# Altium schematic sheet UART.SchDoc
size A3; DocumentNumber: 4; SheetNumber: 4; SheetTotal: 10; PageSetup: Record=PageOptions|CenterHorizontal=True|CenterVertical=True|PrintScale=0.97|XCorrection=1.00|YCorrection=1.00|PrintKind=1|BorderSize=5000000|LeftOffset=0|BottomOffset=0|Orientation=2|PaperLength=2970|PaperWidth=2100|Scale=100|PaperSource=7|PrintQuality=600|MediaType=1|DitherType=10|PaperKind=A4|PrintScaleMode=1
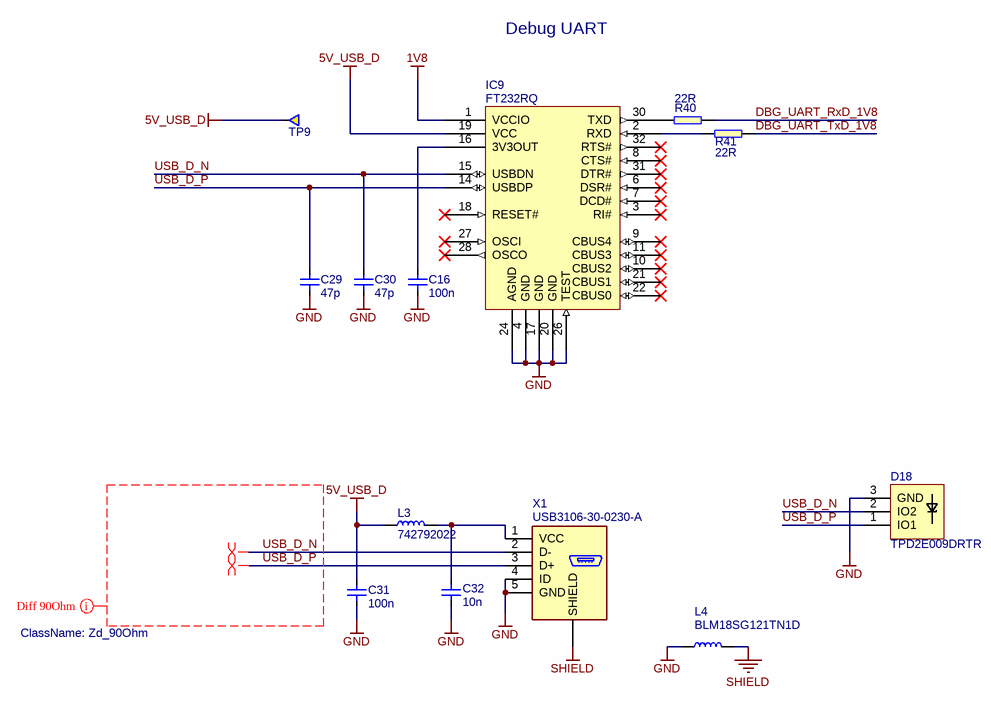
[diagram p0: UART.SchDoc]

## Parts
C16  100n  [0603]
C29  47p  [0402]
C30  47p  [0402]
C31  100n  [0603]
C32  10n  [0603]
D18  TPD2E009DRTR  [SOT-3]
IC9  FT232RQ  [QFN-32]
L3  742792022  [0805]
L4  BLM18SG121TN1D  [0603]
R40  22R  [0603]
R41  22R  [0603]
TP9  (no value)  [TP-R-2]  (no BOM)
X1  USB3106-30-0230-A  [USB3106]

## Nets
1V8: IC9.1(VCCIO)
5V_USB_D: C31.2 IC9.19(VCC) L3.1 TP9.1
GND: C16.1 C29.1 C30.1 C31.1 C32.2 D18.3(GND) IC9.4(GND) IC9.17(GND) IC9.20(GND) IC9.24(AGND) IC9.26(TEST) L4.1 X1.4(ID) X1.5(GND)
SHIELD: L4.2 X1.S(SHIELD)
DBG_UART_RxD_1V8: R40.2
DBG_UART_TxD_1V8: R41.2
USB_D_N: C30.2 D18.2(IO2) IC9.15(USBDN) X1.2(D-)
USB_D_P: C29.2 D18.1(IO1) IC9.14(USBDP) X1.3(D+)
NetC16_2: C16.2 IC9.16(3V3OUT)
NetC32_1: C32.1 L3.2 X1.1(VCC)
NetIC9_2: IC9.2(RXD) R41.1
NetIC9_30: IC9.30(TXD) R40.1

Not connected (* = marked no-connect by the designer): IC9 3(RI#)* 6(DSR#)* 7(DCD#)* 8(CTS#)* 9(CBUS4)* 10(CBUS2)* 11(CBUS3)* 18(RESET#)* 21(CBUS1)* 22(CBUS0)* 27(OSCI)* 28(OSCO)* 31(DTR#)* 32(RTS#)*

## Layout directives
differential pair: USB_D_N, USB_D_P
net class Zd_90Ohm: USB_D_N, USB_D_P

## Notes on the sheet
- Debug UART
- Title:
- Size:
- Date:
- A3
- Revision:
- Page:
- of
- Antmicro Ltd.
- File:
- www.antmicro.com

## Library data of the parts
C16 C31 = C_100n_0603: MLCC SMT Capacitor 100nF 0603; Manufacturer: WALSIN; Part Symbol: 0603B104K500CT; Part Number: C_100n_0603; Value: 100n
C29 C30 = C_47p_0402: MLCC SMT Capacitor 47pF 0402; Manufacturer: KEMET; Part Symbol: C0402C470J5GACTU; Part Number: C_47p_0402; Value: 47p
C32 = C_10n_0603: MLCC SMT Capacitor 10nF 0603; Manufacturer: AVX; Part Symbol: 06031C103JAT2A; Value: 10n; Part Number: C_10n_0603
D18 = TPD2E009: ESD Suppressors 2-CH; Manufacturer: Texas Instruments; Part Number: TPD2E009DRTR; Value: TPD2E009DRTR; Part Symbol: TPD2E009DRTR
IC9 = FT232RQ: USB to serial UART interface; Manufacturer: FTDI; Part Symbol: FT232RQ-REEL; Part Number: FT232RQ; Value: FT232RQ
L3 = 742792022: WURTH ELEKTRONIK - 742792022 - FERRITE BEAD, 0.05OHM, 2A, 0805; Part Number: 742792022; Value: 742792022; Manufacturer: WURTH ELEKTRONIK; Part Symbol: 742792022
L4 = BLM18SG121TN1D: FERRITE BEAD, 0.025OHM, 3A, 0603; Manufacturer: MURATA; Part Number: BLM18SG121TN1D; Value: BLM18SG121TN1D; Part Symbol: BLM18SG121TN1D
R40 R41 = R_22R_0603: SMT Resistor 22R 0603; Manufacturer: BOURNS; Part Symbol: CR0603-JW-220GLF; Part Number: R_22R_0603; Value: 22R
TP9 = TP-R-2: Testpad, round, 2mm; Part Number: TP-R-2
X1 = Micro USB A/B TH Vert: Micro USB A/B TH Vertical; Manufacturer: GLOBAL CONNECTOR TECHNOLOGY; Part Symbol: USB3105-30-A; Part Number: Micro USB A/B TH Vert; Value: USB3106-30-0230-A